# Altium project LedDispBoard.PrjPcb
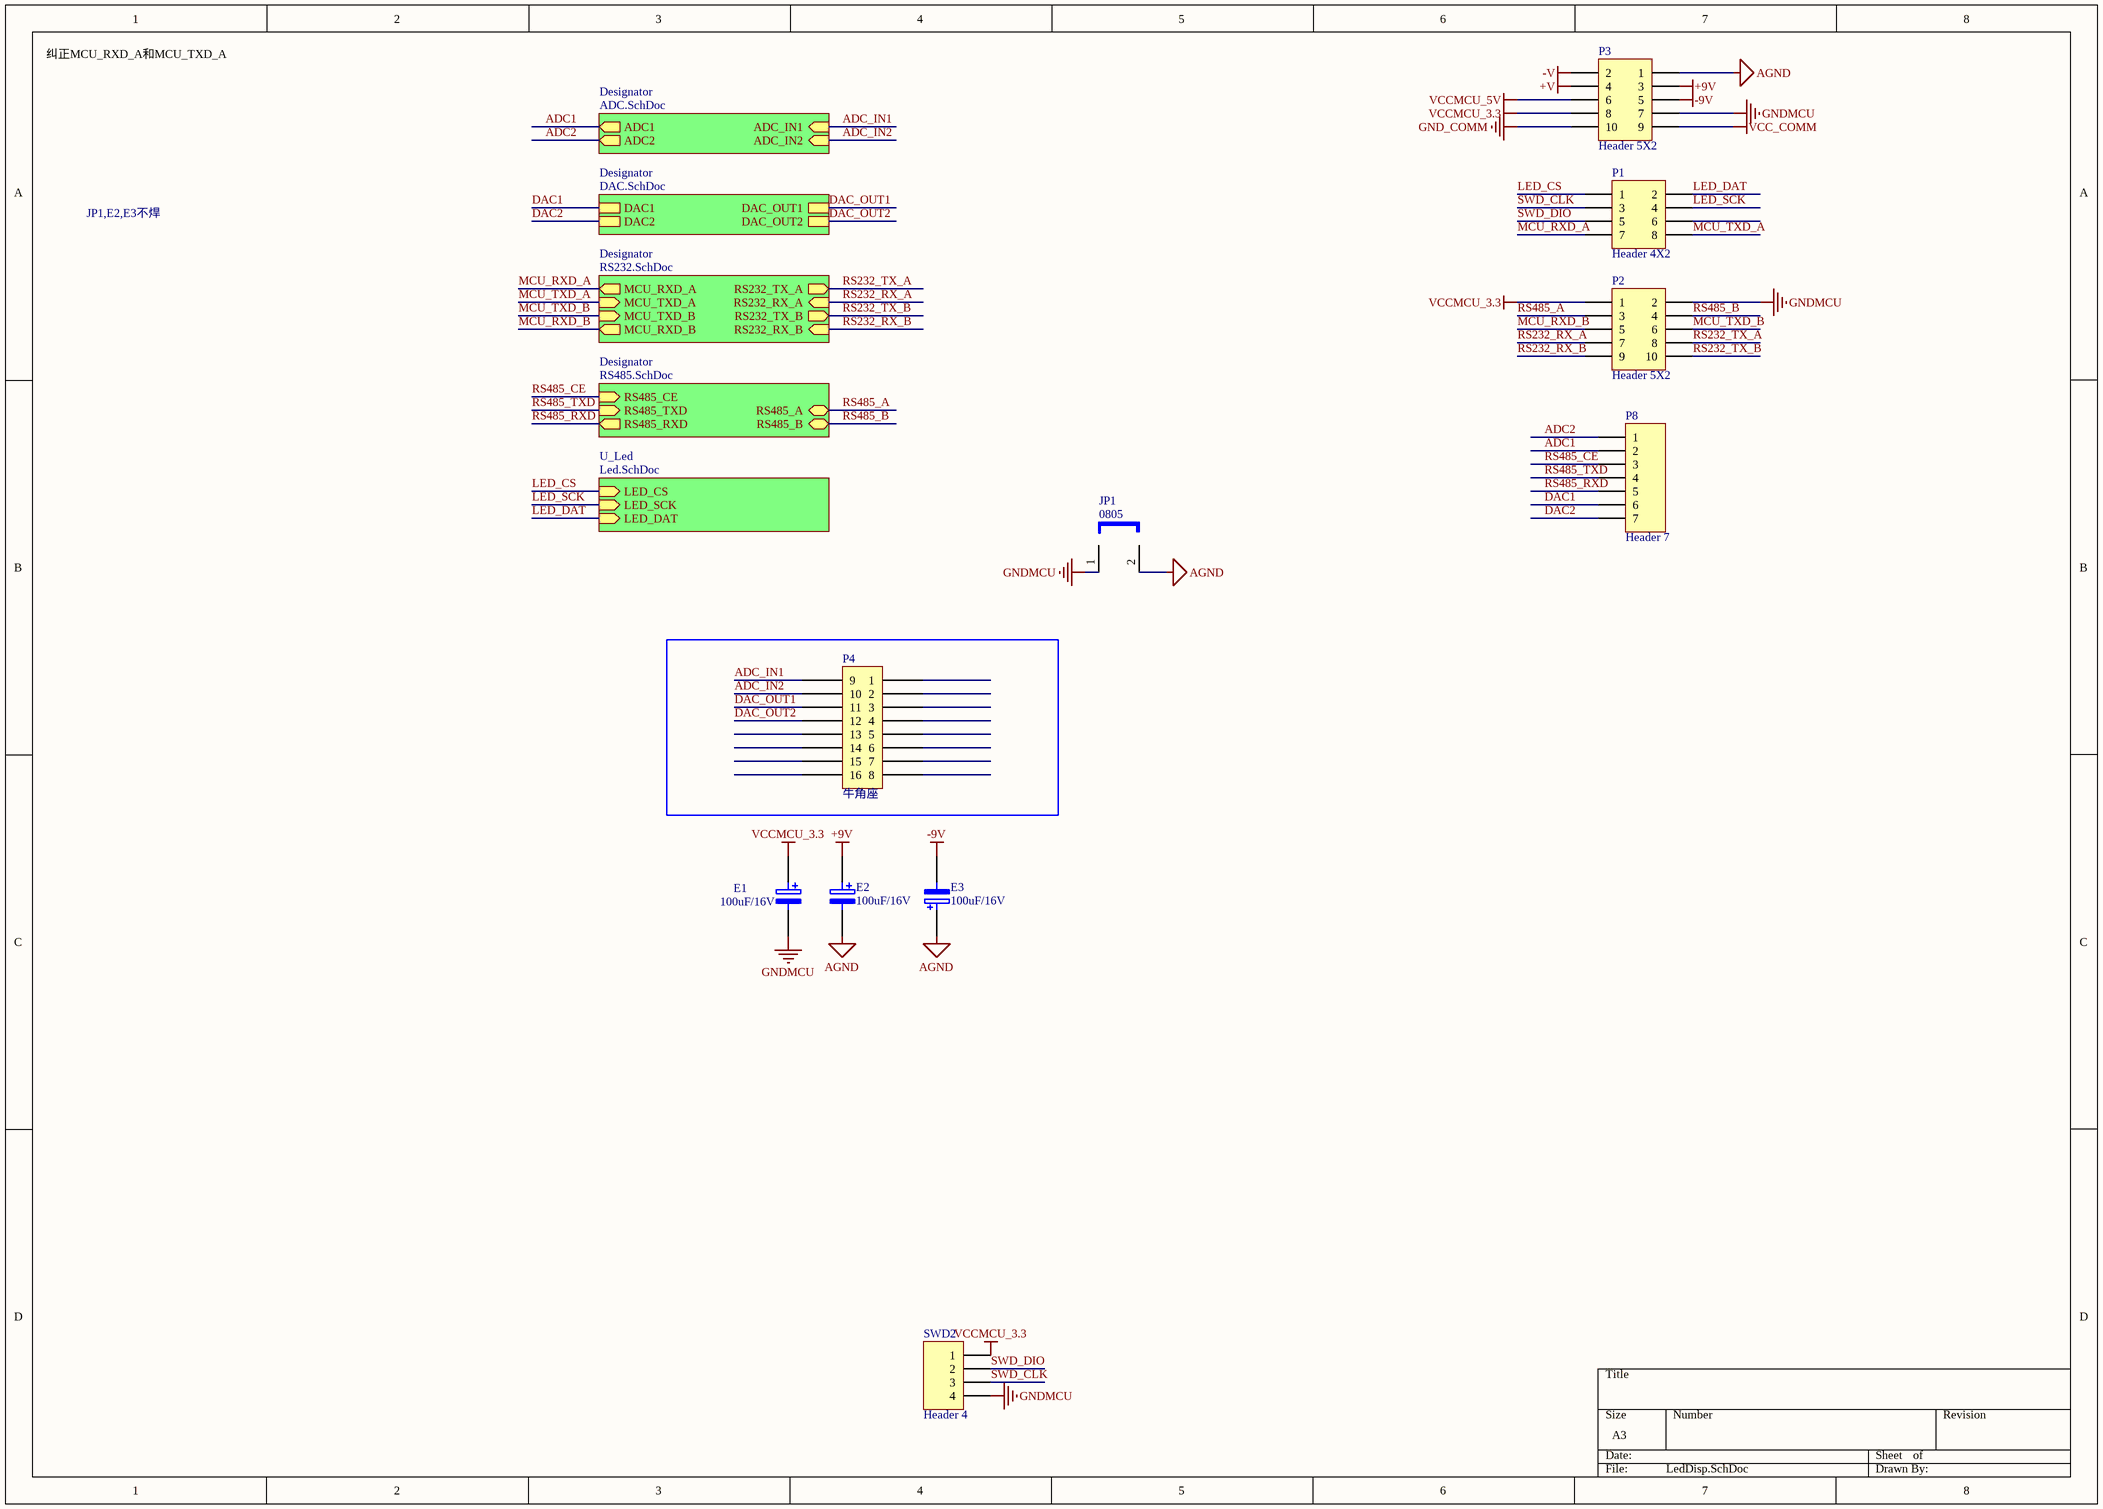
[diagram p0: LedDisp.SchDoc]
6 sheets, 169 parts. Net scope: hierarchical (ports join the sheet entries above them; power ports are global).
Board file: LedDispBoard.PcbDoc
Sheets:
  LedDisp.SchDoc
    Designator = ADC.SchDoc
    Designator = DAC.SchDoc
    Designator = RS232.SchDoc
    Designator = RS485.SchDoc
    U_Led = Led.SchDoc

## Sheet LedDisp.SchDoc
size A3

### Parts
E1  100uF/16V  [C-10UF]
E2  100uF/16V  [C-10UF]
E3  100uF/16V  [C-10UF]
JP1  0805  [RESC_E0805_2012X50N]
P1  Header 4X2  [HDR2X4]
P2  Header 5X2  [HDR2X5]
P3  Header 5X2  [HDR2X5]
P4  牛角座  [2.54* 2*8p]
P8  Header 7  [HDR1X7]
SWD2  Header 4  [HDR1X4]

### Sub-sheets
Designator = ADC.SchDoc: ADC1 (out), ADC_IN2 (in), ADC2 (out), ADC_IN1 (in)
Designator = DAC.SchDoc: DAC2, DAC1, DAC_OUT2, DAC_OUT1
Designator = RS232.SchDoc: RS232_RX_A (in), RS232_TX_A (out), RS232_TX_B (out), MCU_RXD_A (out), MCU_TXD_A (in), MCU_TXD_B (in), RS232_RX_B (in), MCU_RXD_B (out)
Designator = RS485.SchDoc: RS485_A (bidir), RS485_B (bidir), RS485_RXD (out), RS485_TXD (in), RS485_CE (in)
U_Led = Led.SchDoc: LED_CS (in), LED_SCK (in), LED_DAT (in)

### Nets
+9V: E2.1 P3.3
+V: P3.4
-9V: E3.2 P3.5
-V: P3.2
AGND: E2.2 E3.1 JP1.2 P3.1
GND_COMM: P3.10
GNDMCU: E1.2 JP1.1 P2.2 P3.7 SWD2.4
VCC_COMM: P3.9
VCCMCU_3.3: E1.1 P2.1 P3.8 SWD2.1
VCCMCU_5V: P3.6
ADC1: P8.2 ; sheet Designator/ADC1
ADC2: P8.1 ; sheet Designator/ADC2
ADC_IN1: P4.9 ; sheet Designator/ADC_IN1
ADC_IN2: P4.10 ; sheet Designator/ADC_IN2
DAC1: P8.6 ; sheet Designator/DAC1
DAC2: P8.7 ; sheet Designator/DAC2
DAC_OUT1: P4.11 ; sheet Designator/DAC_OUT1
DAC_OUT2: P4.12 ; sheet Designator/DAC_OUT2
LED_CS: P1.1 ; sheet U_Led/LED_CS
LED_DAT: P1.2 ; sheet U_Led/LED_DAT
LED_SCK: P1.4 ; sheet U_Led/LED_SCK
MCU_RXD_A: P1.7 ; sheet Designator/MCU_RXD_A
MCU_RXD_B: P2.5 ; sheet Designator/MCU_RXD_B
MCU_TXD_A: P1.8 ; sheet Designator/MCU_TXD_A
MCU_TXD_B: P2.6 ; sheet Designator/MCU_TXD_B
RS232_RX_A: P2.7 ; sheet Designator/RS232_RX_A
RS232_RX_B: P2.9 ; sheet Designator/RS232_RX_B
RS232_TX_A: P2.8 ; sheet Designator/RS232_TX_A
RS232_TX_B: P2.10 ; sheet Designator/RS232_TX_B
RS485_A: P2.3 ; sheet Designator/RS485_A
RS485_B: P2.4 ; sheet Designator/RS485_B
RS485_CE: P8.3 ; sheet Designator/RS485_CE
RS485_RXD: P8.5 ; sheet Designator/RS485_RXD
RS485_TXD: P8.4 ; sheet Designator/RS485_TXD
SWD_CLK: P1.3 SWD2.3
SWD_DIO: P1.5 SWD2.2

Not connected (* = marked no-connect by the designer): P1 6; P4 1 2 3 4 5 6 7 8 13 14 15 16

### Notes on the sheet
- 纠正MCU_RXD_A和MCU_TXD_A
- JP1,E2,E3不焊

### Library data of the parts
E1-E3 = ELECTRO2: Electrolytic Capacitor
JP1 = JUMPER
P1 = Header 4X2: Header, 4-Pin, Dual row; LatestRevisionDate: 17-Jul-2002; LatestRevisionNote: Re-released for DXP Platform.; Publisher: Altium Limited
P2 P3 = Header 5X2: Header, 5-Pin, Dual row; LatestRevisionDate: 17-Jul-2002; LatestRevisionNote: Re-released for DXP Platform.; Publisher: Altium Limited
P4 = CON2*8
P8 = Header 7: Header, 7-Pin; LatestRevisionDate: 17-Jul-2002; LatestRevisionNote: Re-released for DXP Platform.; Publisher: Altium Limited
SWD2 = Header 4: Header, 4-Pin; LatestRevisionDate: 17-Jul-2002; LatestRevisionNote: Re-released for DXP Platform.; Publisher: Altium Limited

## Sheet ADC.SchDoc
size A3
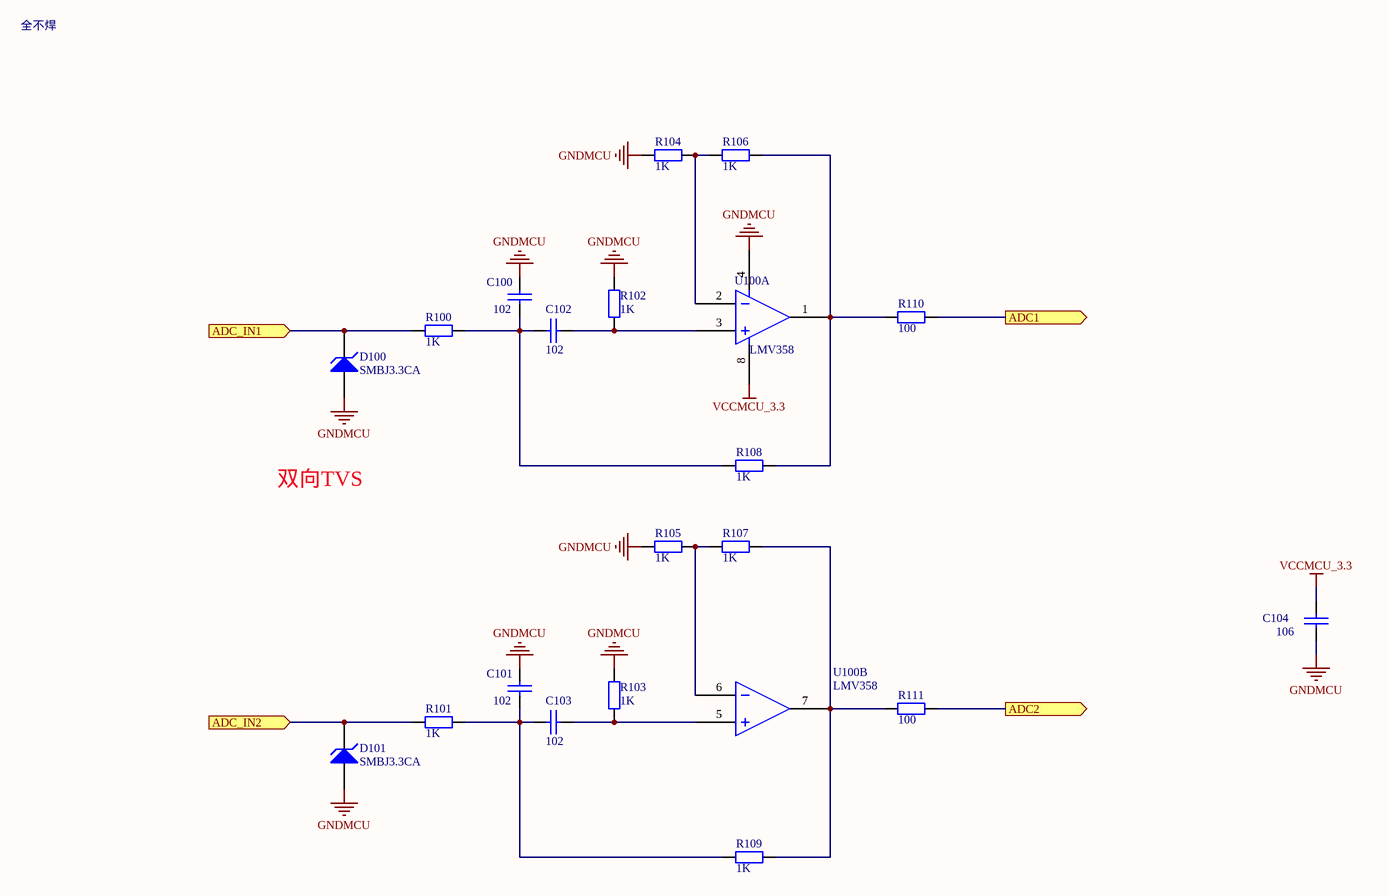
[diagram p1: ADC.SchDoc]

### Parts
C100  102  [0805/C2]
C101  102  [0805/C2]
C102  102  [0805/C2]
C103  102  [0805/C2]
C104  106  [0805/C2]
D100  SMBJ3.3CA  [SMB]
D101  SMBJ3.3CA  [SMB]
R100  1K  [0805/R2]
R101  1K  [0805/R2]
R102  1K  [0805/R2]
R103  1K  [0805/R2]
R104  1K  [0805/R2]
R105  1K  [0805/R2]
R106  1K  [0805/R2]
R107  1K  [0805/R2]
R108  1K  [0805/R2]
R109  1K  [0805/R2]
R110  100  [0805/R2]
R111  100  [0805/R2]
U100  LMV358  [SO-8]  (parts A,B of 2)

### Ports
ADC1 (out), ADC2 (out), ADC_IN1 (in), ADC_IN2 (in)

### Nets
GNDMCU: C100.1 C101.1 C104.2 D100.1(A) D101.1(A) R102.1 R103.1 R104.1 R105.1 U100.4
VCCMCU_3.3: C104.1 U100.8
ADC1: R110.1 ; port ADC1
ADC2: R111.1 ; port ADC2
ADC_IN1: D100.2(K) R100.2 ; port ADC_IN1
ADC_IN2: D101.2(K) R101.2 ; port ADC_IN2
NetC100_2: C100.2 C102.1 R100.1 R108.2
NetC101_2: C101.2 C103.1 R101.1 R109.2
NetC102_2: C102.2 R102.2 U100.3
NetC103_2: C103.2 R103.2 U100.5
NetR104_2: R104.2 R106.2 U100.2
NetR105_2: R105.2 R107.2 U100.6
NetR106_1: R106.1 R108.1 R110.2 U100.1
NetR107_1: R107.1 R109.1 R111.2 U100.7

### Notes on the sheet
- 全不焊
- 双向TVS

### Library data of the parts
C100-C104 = CAP: Capacitor
D100 D101 = D Zener: Zener Diode; Published: 8-Jun-2000; LatestRevisionDate: 17-Jul-2002; LatestRevisionNote: Re-released for DXP Platform.; PackageReference: DIODE-0.7; Publisher: Altium Limited
R100-R111 = RES1
U100 = 1458

## Sheet DAC.SchDoc
size A3
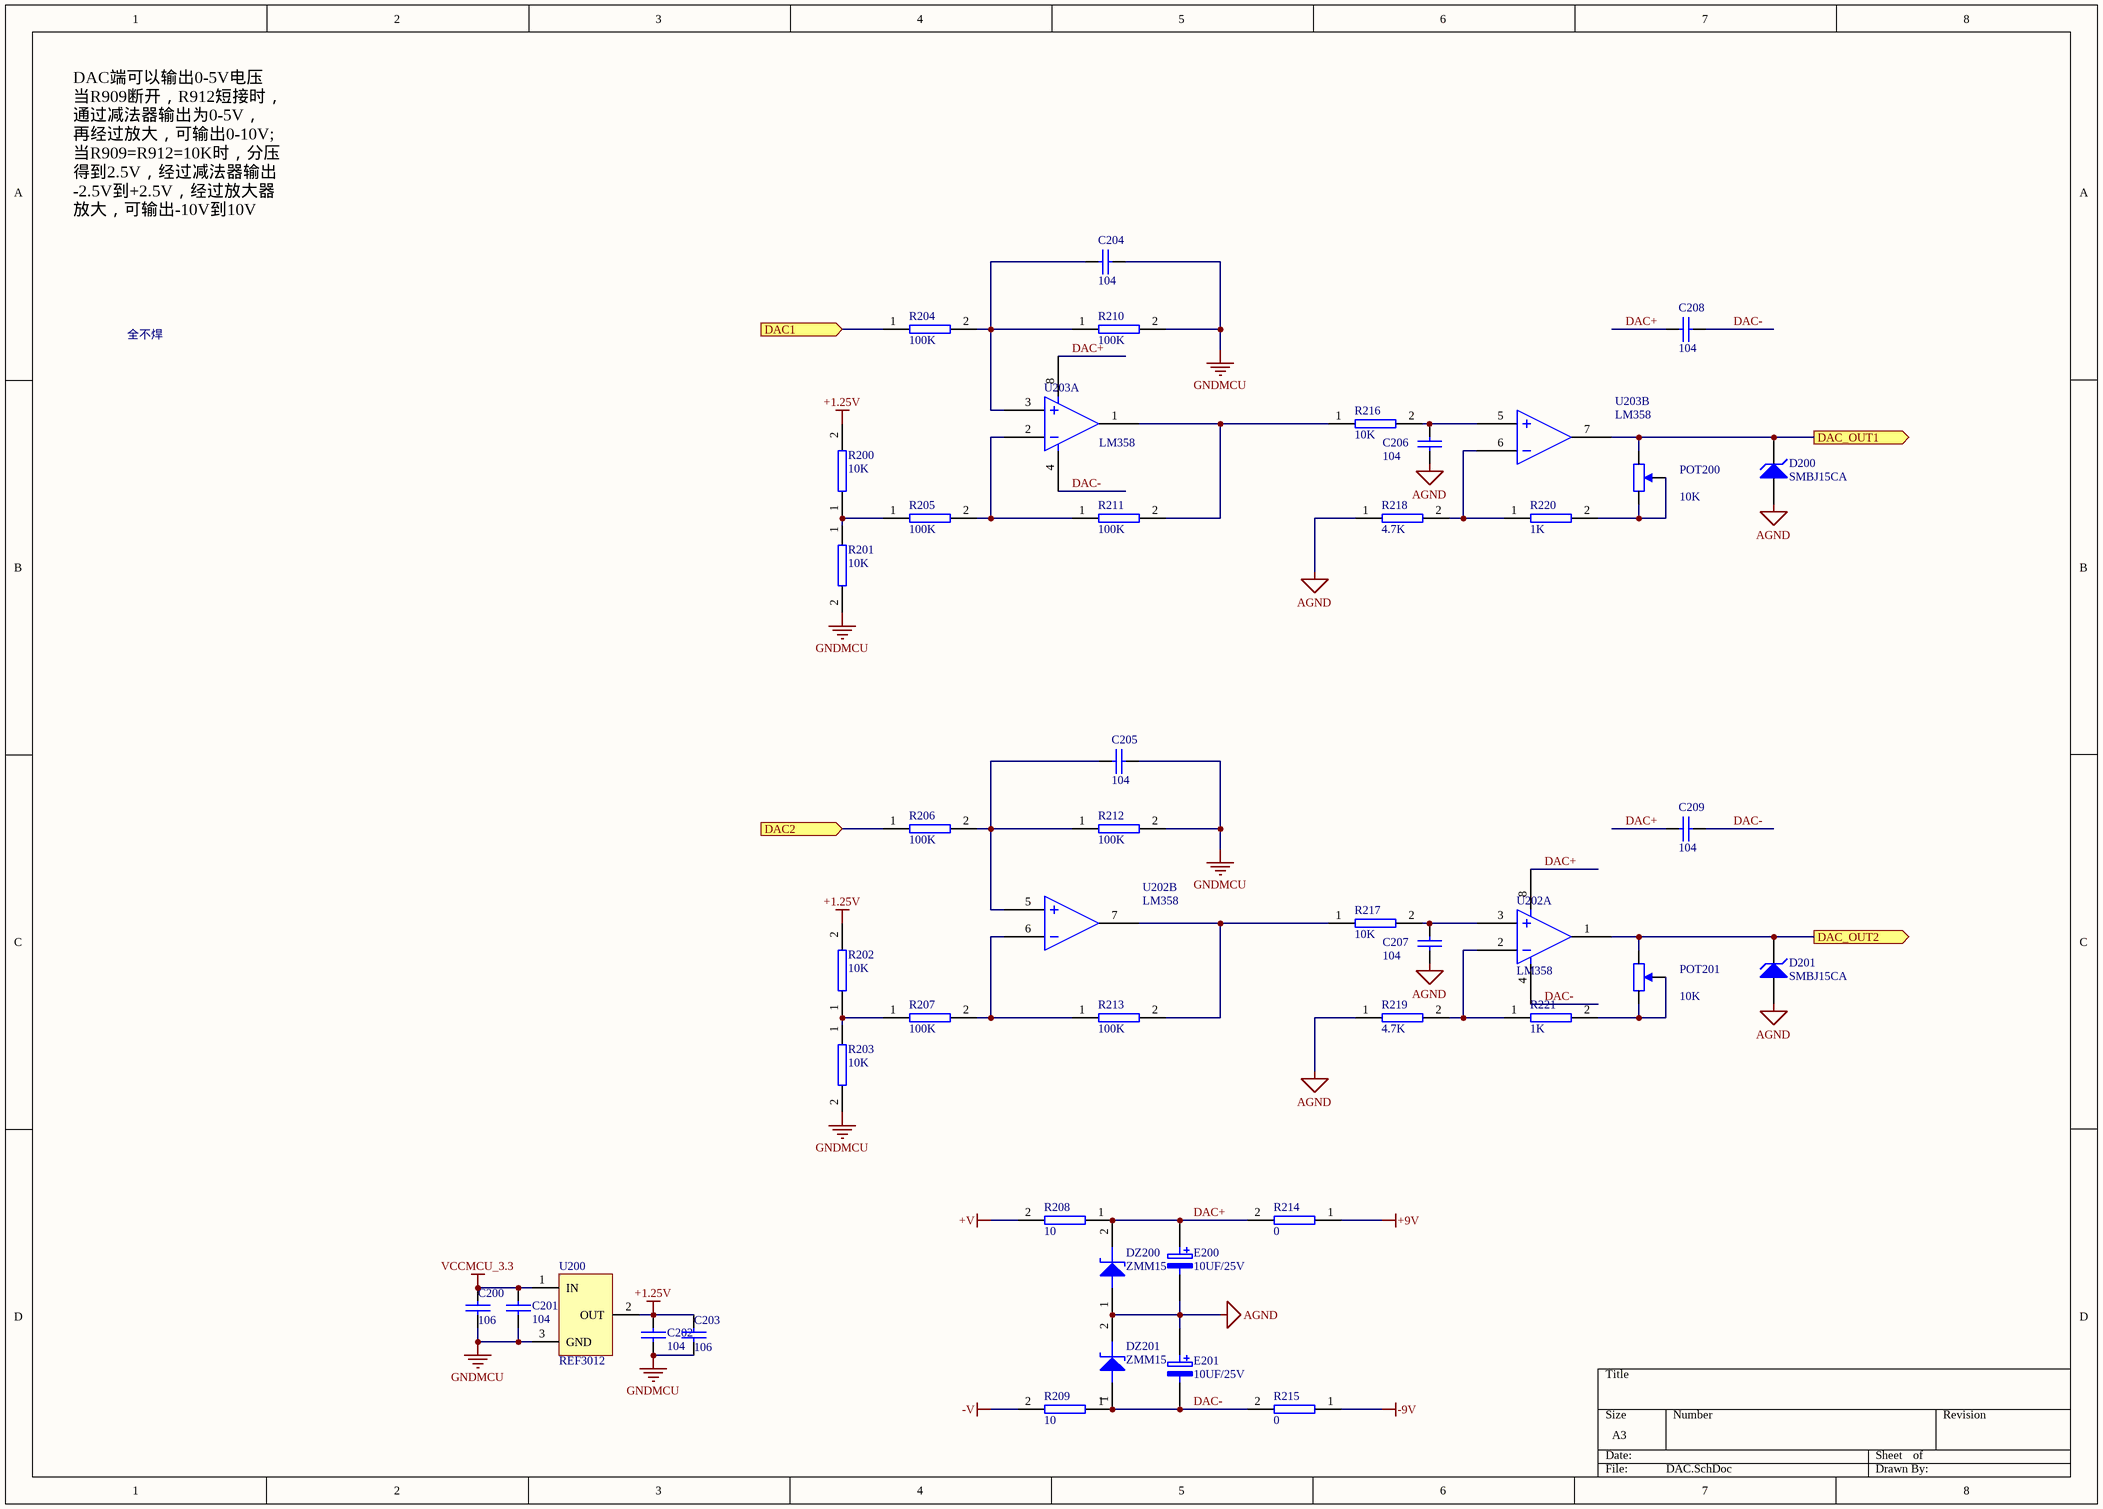
[diagram p2: DAC.SchDoc]

### Parts
C200  106  [0805/C2]
C201  104  [0805/C2]
C202  104  [0805/C2]
C203  106  [0805/C2]
C204  104  [0805/C2]
C205  104  [0805/C2]
C206  104  [0805/C2]
C207  104  [0805/C2]
C208  104  [0805/C2]
C209  104  [0805/C2]
D200  SMBJ15CA  [SMB]
D201  SMBJ15CA  [SMB]
DZ200  ZMM15  [N4148]
DZ201  ZMM15  [N4148]
E200  10UF/25V  [C-10UF]
E201  10UF/25V  [C-10UF]
POT200  10K  [RPOT-3296W]
POT201  10K  [rpOT-3296W]
R200  10K  [RESC_E0805_2012X50N]
R201  10K  [RESC_E0805_2012X50N]
R202  10K  [RESC_E0805_2012X50N]
R203  10K  [RESC_E0805_2012X50N]
R204  100K  [RESC_E0805_2012X50N]
R205  100K  [RESC_E0805_2012X50N]
R206  100K  [RESC_E0805_2012X50N]
R207  100K  [RESC_E0805_2012X50N]
R208  10  [RESC_E0805_2012X50N]
R209  10  [RESC_E0805_2012X50N]
R210  100K  [RESC_E0805_2012X50N]
R211  100K  [RESC_E0805_2012X50N]
R212  100K  [RESC_E0805_2012X50N]
R213  100K  [RESC_E0805_2012X50N]
R214  0  [RESC_E0805_2012X50N]
R215  0  [RESC_E0805_2012X50N]
R216  10K  [RESC_E0805_2012X50N]
R217  10K  [RESC_E0805_2012X50N]
R218  4.7K  [RESC_E0805_2012X50N]
R219  4.7K  [RESC_E0805_2012X50N]
R220  1K  [RESC_E0805_2012X50N]
R221  1K  [RESC_E0805_2012X50N]
U200  REF3012  [SOT-23]
U202  LM358  [sO-8]  (parts A,B of 2)
U203  LM358  [so-8]  (parts A,B of 2)

### Ports
DAC1 (in), DAC2 (in), DAC_OUT1 (out), DAC_OUT2 (out)

### Nets
+1.25V: C202.1 C203.2 R200.2 R202.2 U200.2(OUT)
+9V: R214.1
+V: R208.2
-9V: R215.1
-V: R209.2
AGND: C206.1 C207.1 D200.1(A) D201.1(A) DZ200.1 DZ201.2 E200.2 E201.1 R218.1 R219.1
GNDMCU: C200.1 C201.2 C202.2 C203.1 C204.2 C205.2 R201.2 R203.2 R210.2 R212.2 U200.3(GND)
VCCMCU_3.3: C200.2 C201.1 U200.1(IN)
DAC1: R204.1 ; port DAC1
DAC2: R206.1 ; port DAC2
DAC+: C208.1 C209.1 DZ200.2 E200.1 R208.1 R214.2 U202.8 U203.8
DAC-: C208.2 C209.2 DZ201.1 E201.2 R209.1 R215.2 U202.4 U203.4
DAC_OUT1: D200.2(K) POT200.1 U203.7 ; port DAC_OUT1
DAC_OUT2: D201.2(K) POT201.1 U202.1 ; port DAC_OUT2
NetC204_1: C204.1 R204.2 R210.1 U203.3
NetC205_1: C205.1 R206.2 R212.1 U202.5
NetC206_2: C206.2 R216.2 U203.5
NetC207_2: C207.2 R217.2 U202.3
NetPOT200_2: POT200.2 POT200.3 R220.2
NetPOT201_2: POT201.2 POT201.3 R221.2
NetR200_1: R200.1 R201.1 R205.1
NetR202_1: R202.1 R203.1 R207.1
NetR205_2: R205.2 R211.1 U203.2
NetR207_2: R207.2 R213.1 U202.6
NetR211_2: R211.2 R216.1 U203.1
NetR213_2: R213.2 R217.1 U202.7
NetR218_2: R218.2 R220.1 U203.6
NetR219_2: R219.2 R221.1 U202.2

### Notes on the sheet
- DAC端可以输出0-5V电压
  当R909断开，R912短接时，
  通过减法器输出为0-5V，
  再经过放大，可输出0-10V;
  当R909=R912=10K时，分压
  得到2.5V，经过减法器输出
  -2.5V到+2.5V，经过放大器
  放大，可输出-10V到10V
- 全不焊

### Library data of the parts
C200-C209 = CAP: Capacitor
D200 D201 = D Zener: Zener Diode; Published: 8-Jun-2000; LatestRevisionDate: 17-Jul-2002; LatestRevisionNote: Re-released for DXP Platform.; PackageReference: DIODE-0.7; Publisher: Altium Limited
DZ200 DZ201 = ZENER2: 15v/0.5W
E200 E201 = ELECTRO2: Electrolytic Capacitor
POT200 POT201 = RPOT2
R200-R221 = RES2
U200 = REF3020: 2.048V ,HIGH OUTPUT CURRENT: 25mA,HIGH ACCURACY: 0.2%
U202 U203 = 1458

## Sheet RS232.SchDoc
size A2; DocumentNumber: 4; SheetNumber: 4; SheetTotal: 9
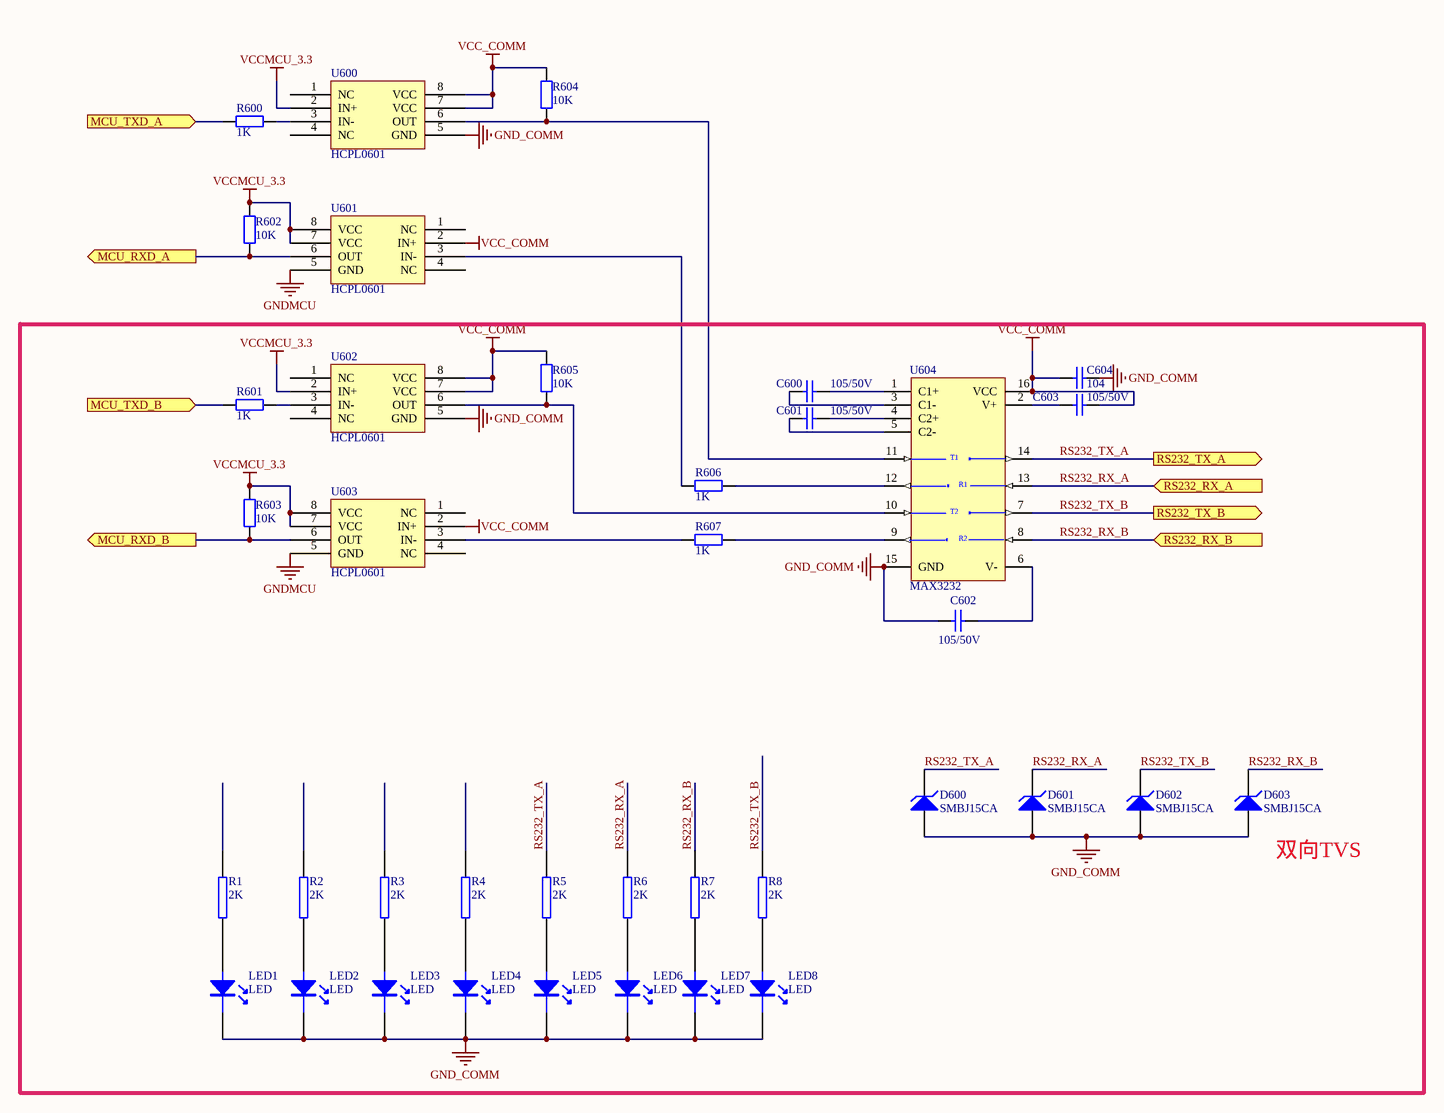
[diagram p3: RS232.SchDoc]

### Parts
C600  105/50V  [0805/C2]
C601  105/50V  [0805/C2]
C602  105/50V  [0805/C2]
C603  105/50V  [0805/C2]
C604  104  [0805/C2]
D600  SMBJ15CA  [SMB]
D601  SMBJ15CA  [SMB]
D602  SMBJ15CA  [SMB]
D603  SMBJ15CA  [SMB]
LED1  LED  [LED0805]
LED2  LED  [LED0805]
LED3  LED  [LED0805]
LED4  LED  [LED0805]
LED5  LED  [LED0805]
LED6  LED  [LED0805]
LED7  LED  [LED0805]
LED8  LED  [LED0805]
R1  2K  [0805/R2]
R2  2K  [0805/R2]
R3  2K  [0805/R2]
R4  2K  [0805/R2]
R5  2K  [0805/R2]
R6  2K  [0805/R2]
R7  2K  [0805/R2]
R8  2K  [0805/R2]
R600  1K  [0805/R2]
R601  1K  [0805/R2]
R602  10K  [0805/R2]
R603  10K  [0805/R2]
R604  10K  [0805/R2]
R605  10K  [0805/R2]
R606  1K  [0805/R2]
R607  1K  [RESC_E0805_2012X50N]
U600  HCPL0601  [HCPL0601]
U601  HCPL0601  [HCPL0601]
U602  HCPL0601  [HCPL0601]
U603  HCPL0601  [HCPL0601]
U604  MAX3232  [SO-16]

### Blocks framed on the sheet
双向TVS: C600-C604 D600-D603 LED1-LED8 R1-R8 R601 R603 R605-R607 U602-U604

### Ports
MCU_RXD_A (out), MCU_RXD_B (out), MCU_TXD_A (in), MCU_TXD_B (in), RS232_RX_A (in), RS232_RX_B (in), RS232_TX_A (out), RS232_TX_B (out)

### Nets
GND_COMM: C602.1 C604.1 D600.1(A) D601.1(A) D602.1(A) D603.1(A) LED1.2 LED2.2 LED3.2 LED4.2 LED5.2 LED6.2 LED7.2 LED8.2 U600.5(GND) U602.5(GND) U604.15(GND)
GNDMCU: U601.5(GND) U603.5(GND)
VCC_COMM: C603.2 C604.2 R604.2 R605.2 U600.7(VCC) U600.8(VCC) U601.2(IN+) U602.7(VCC) U602.8(VCC) U603.2(IN+) U604.16(VCC)
VCCMCU_3.3: R602.2 R603.2 U600.2(IN+) U601.7(VCC) U601.8(VCC) U602.2(IN+) U603.7(VCC) U603.8(VCC)
MCU_RXD_A: R602.1 U601.6(OUT) ; port MCU_RXD_A
MCU_RXD_B: R603.1 U603.6(OUT) ; port MCU_RXD_B
MCU_TXD_A: R600.1 ; port MCU_TXD_A
MCU_TXD_B: R601.1 ; port MCU_TXD_B
RS232_RX_A: D601.2(K) R6.2 U604.13(R1IN) ; port RS232_RX_A
RS232_RX_B: D603.2(K) R7.2 U604.8(R2IN) ; port RS232_RX_B
RS232_TX_A: D600.2(K) R5.2 U604.14(T1OUT) ; port RS232_TX_A
RS232_TX_B: D602.2(K) R8.2 U604.7(T2OUT) ; port RS232_TX_B
NetC600_1: C600.1 U604.1(C1+)
NetC600_2: C600.2 U604.3(C1-)
NetC601_1: C601.1 U604.4(C2+)
NetC601_2: C601.2 U604.5(C2-)
NetC602_2: C602.2 U604.6(V-)
NetC603_1: C603.1 U604.2(V+)
NetLED1_1: LED1.1 R1.1
NetLED2_1: LED2.1 R2.1
NetLED3_1: LED3.1 R3.1
NetLED4_1: LED4.1 R4.1
NetLED5_1: LED5.1 R5.1
NetLED6_1: LED6.1 R6.1
NetLED7_1: LED7.1 R7.1
NetLED8_1: LED8.1 R8.1
NetR600_2: R600.2 U600.3(IN-)
NetR601_2: R601.2 U602.3(IN-)
NetR604_1: R604.1 U600.6(OUT) U604.11(T1IN)
NetR605_1: R605.1 U602.6(OUT) U604.10(T2IN)
NetR606_1: R606.1 U601.3(IN-)
NetR606_2: R606.2 U604.12(R1OUT)
NetR607_1: R607.1 U603.3(IN-)
NetR607_2: R607.2 U604.9(R2OUT)

Not connected (* = marked no-connect by the designer): R1 2; R2 2; R3 2; R4 2; U600 1(NC) 4(NC); U601 1(NC) 4(NC); U602 1(NC) 4(NC); U603 1(NC) 4(NC)

### Notes on the sheet
- (in symbol MAX3232) T1; R1; T2; R2

### Library data of the parts
C600-C604 = CAP: Capacitor; Published: 8-Jun-2000; LatestRevisionDate: 17-Jul-2002; LatestRevisionNote: Re-released for DXP Platform.; PackageReference: RAD-0.3; Publisher: Altium Limited
D600-D603 = D Zener: Zener Diode; Published: 8-Jun-2000; LatestRevisionDate: 17-Jul-2002; LatestRevisionNote: Re-released for DXP Platform.; PackageReference: DIODE-0.7; Publisher: Altium Limited
LED1-LED8 = LED-PH
R1-R8 = RES2
R600-R607 = RES1
U600-U603 = 6N137

## Sheet RS485.SchDoc
size A4; DocumentNumber: 6; SheetNumber: 6; SheetTotal: 9
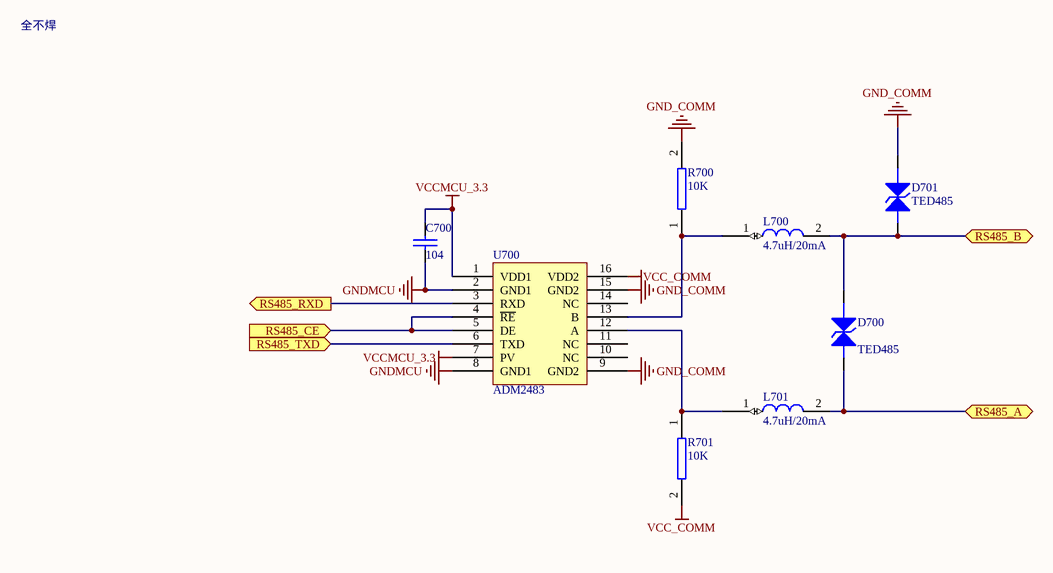
[diagram p4: RS485.SchDoc]

### Parts
C700  104  [0805/C2]
D700  TED485  [TED485]
D701  TED485  [TED485]
L700  4.7uH/20mA  [1210]
L701  4.7uH/20mA  [1210]
R700  10K  [0805/R2]
R701  10K  [0805/R2]
U700  ADM2483  [ADM2483-16]

### Ports
RS485_A (bidir), RS485_B (bidir), RS485_CE (in), RS485_RXD (out), RS485_TXD (in)

### Nets
GND_COMM: D701.2 R700.2 U700.9(GND2) U700.15(GND2)
GNDMCU: C700.1 U700.2(GND1) U700.8(GND1)
VCC_COMM: R701.2 U700.16(VDD2)
VCCMCU_3.3: C700.2 U700.1(VDD1) U700.7(PV)
RS485_A: D700.1 L701.2 ; port RS485_A
RS485_B: D700.2 D701.1 L700.2 ; port RS485_B
RS485_CE: U700.4(~{RE}) U700.5(DE) ; port RS485_CE
RS485_RXD: U700.3(RXD) ; port RS485_RXD
RS485_TXD: U700.6(TXD) ; port RS485_TXD
NetL700_1: L700.1 R700.1 U700.13(B)
NetL701_1: L701.1 R701.1 U700.12(A)

Not connected (* = marked no-connect by the designer): U700 10(NC) 11(NC) 14(NC)

### Notes on the sheet
- 全不焊
- Title
- Size:
- Date:
- A4
- Number:
- Time:
- Revision:
- Sheet
- of
- File:

### Library data of the parts
C700 = CAP: Capacitor
L700 L701 = FUSE
R700 R701 = RES2
U700 = RSM485CHT

## Sheet Led.SchDoc
size A3
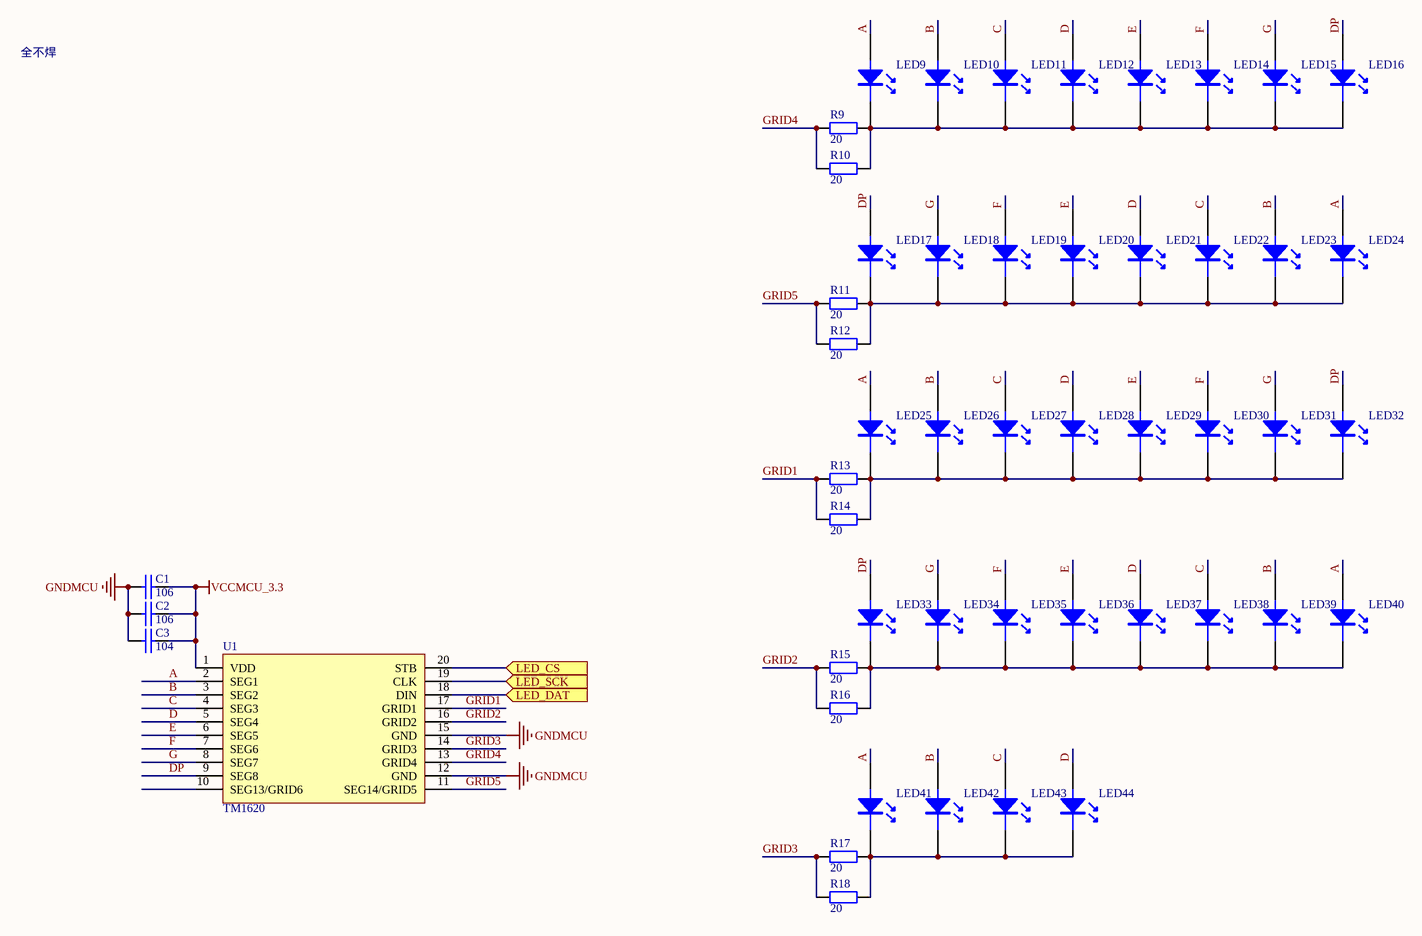
[diagram p5: Led.SchDoc]

### Parts
C1  106  [0805/C2]
C2  106  [0805/C2]
C3  104  [0805/C2]
LED9  (no value)  [LED0805]
LED10  (no value)  [LED0805]
LED11  (no value)  [LED0805]
LED12  (no value)  [LED0805]
LED13  (no value)  [LED0805]
LED14  (no value)  [LED0805]
LED15  (no value)  [LED0805]
LED16  (no value)  [LED0805]
LED17  (no value)  [LED0805]
LED18  (no value)  [LED0805]
LED19  (no value)  [LED0805]
LED20  (no value)  [LED0805]
LED21  (no value)  [LED0805]
LED22  (no value)  [LED0805]
LED23  (no value)  [LED0805]
LED24  (no value)  [LED0805]
LED25  (no value)  [LED0805]
LED26  (no value)  [LED0805]
LED27  (no value)  [LED0805]
LED28  (no value)  [LED0805]
LED29  (no value)  [LED0805]
LED30  (no value)  [LED0805]
LED31  (no value)  [LED0805]
LED32  (no value)  [LED0805]
LED33  (no value)  [LED0805]
LED34  (no value)  [LED0805]
LED35  (no value)  [LED0805]
LED36  (no value)  [LED0805]
LED37  (no value)  [LED0805]
LED38  (no value)  [LED0805]
LED39  (no value)  [LED0805]
LED40  (no value)  [LED0805]
LED41  (no value)  [LED0805]
LED42  (no value)  [LED0805]
LED43  (no value)  [LED0805]
LED44  (no value)  [LED0805]
R9  20  [0805/R2]
R10  20  [0805/R2]
R11  20  [0805/R2]
R12  20  [0805/R2]
R13  20  [0805/R2]
R14  20  [0805/R2]
R15  20  [0805/R2]
R16  20  [0805/R2]
R17  20  [0805/R2]
R18  20  [0805/R2]
U1  TM1620  [SOL-20]

### Ports
LED_CS (in), LED_DAT (in), LED_SCK (in)

### Nets
GNDMCU: C1.2 C2.2 C3.1 U1.12(GND) U1.15(GND)
VCCMCU_3.3: C1.1 C2.1 C3.2 U1.1(VDD)
A: LED9.1 LED24.1 LED25.1 LED40.1 LED41.1 U1.2(SEG1)
B: LED10.1 LED23.1 LED26.1 LED39.1 LED42.1 U1.3(SEG2)
C: LED11.1 LED22.1 LED27.1 LED38.1 LED43.1 U1.4(SEG3)
D: LED12.1 LED21.1 LED28.1 LED37.1 LED44.1 U1.5(SEG4)
DP: LED16.1 LED17.1 LED32.1 LED33.1 U1.9(SEG8)
E: LED13.1 LED20.1 LED29.1 LED36.1 U1.6(SEG5)
F: LED14.1 LED19.1 LED30.1 LED35.1 U1.7(SEG6)
G: LED15.1 LED18.1 LED31.1 LED34.1 U1.8(SEG7)
GRID1: R13.1 R14.1 U1.17(GRID1)
GRID2: R15.1 R16.1 U1.16(GRID2)
GRID3: R17.1 R18.1 U1.14(GRID3)
GRID4: R9.1 R10.1 U1.13(GRID4)
GRID5: R11.1 R12.1 U1.11(SEG14/GRID5)
LED_CS: U1.20(STB) ; port LED_CS
LED_DAT: U1.18(DIN) ; port LED_DAT
LED_SCK: U1.19(CLK) ; port LED_SCK
NetLED9_2: LED9.2 LED10.2 LED11.2 LED12.2 LED13.2 LED14.2 LED15.2 LED16.2 R9.2 R10.2
NetLED17_2: LED17.2 LED18.2 LED19.2 LED20.2 LED21.2 LED22.2 LED23.2 LED24.2 R11.2 R12.2
NetLED25_2: LED25.2 LED26.2 LED27.2 LED28.2 LED29.2 LED30.2 LED31.2 LED32.2 R13.2 R14.2
NetLED33_2: LED33.2 LED34.2 LED35.2 LED36.2 LED37.2 LED38.2 LED39.2 LED40.2 R15.2 R16.2
NetLED41_2: LED41.2 LED42.2 LED43.2 LED44.2 R17.2 R18.2

Not connected (* = marked no-connect by the designer): U1 10(SEG13/GRID6)

### Notes on the sheet
- 全不焊
- Title
- Size:
- Date:
- A3
- Number:
- Time:
- Revision:
- Sheet
- of
- File:

### Library data of the parts
C1-C3 = CAP: Capacitor
LED9-LED44 = LED-PH
R9-R18 = RES1
U1 = TM1620: 8 段×6 位～10段×4位 串行接口 共阴

## Nets that join several sheets
+9V: LedDisp (E2.1 P3.3), DAC (R214.1)
+V: LedDisp (P3.4), DAC (R208.2)
-9V: LedDisp (E3.2 P3.5), DAC (R215.1)
-V: LedDisp (P3.2), DAC (R209.2)
AGND: LedDisp (E2.2 E3.1 JP1.2 P3.1), DAC (10 pins)
GND_COMM: LedDisp (P3.10), RS232 (17 pins), RS485 (D701.2 R700.2 U700.9 U700.15)
GNDMCU: LedDisp (5 pins), ADC (10 pins), DAC (11 pins), RS232 (U601.5 U603.5), RS485 (C700.1 U700.2 U700.8), Led (5 pins)
VCC_COMM: LedDisp (P3.9), RS232 (11 pins), RS485 (R701.2 U700.16)
VCCMCU_3.3: LedDisp (E1.1 P2.1 P3.8 SWD2.1), ADC (C104.1 U100.8), DAC (C200.2 C201.1 U200.1), RS232 (8 pins), RS485 (C700.2 U700.1 U700.7), Led (C1.1 C2.1 C3.2 U1.1)
ADC1: LedDisp (P8.2), ADC (R110.1)
ADC2: LedDisp (P8.1), ADC (R111.1)
ADC_IN1: LedDisp (P4.9), ADC (D100.2 R100.2)
ADC_IN2: LedDisp (P4.10), ADC (D101.2 R101.2)
DAC1: LedDisp (P8.6), DAC (R204.1)
DAC2: LedDisp (P8.7), DAC (R206.1)
DAC_OUT1: LedDisp (P4.11), DAC (D200.2 POT200.1 U203.7)
DAC_OUT2: LedDisp (P4.12), DAC (D201.2 POT201.1 U202.1)
LED_CS: LedDisp (P1.1), Led (U1.20)
LED_DAT: LedDisp (P1.2), Led (U1.18)
LED_SCK: LedDisp (P1.4), Led (U1.19)
MCU_RXD_A: LedDisp (P1.7), RS232 (R602.1 U601.6)
MCU_RXD_B: LedDisp (P2.5), RS232 (R603.1 U603.6)
MCU_TXD_A: LedDisp (P1.8), RS232 (R600.1)
MCU_TXD_B: LedDisp (P2.6), RS232 (R601.1)
RS232_RX_A: LedDisp (P2.7), RS232 (D601.2 R6.2 U604.13)
RS232_RX_B: LedDisp (P2.9), RS232 (D603.2 R7.2 U604.8)
RS232_TX_A: LedDisp (P2.8), RS232 (D600.2 R5.2 U604.14)
RS232_TX_B: LedDisp (P2.10), RS232 (D602.2 R8.2 U604.7)
RS485_A: LedDisp (P2.3), RS485 (D700.1 L701.2)
RS485_B: LedDisp (P2.4), RS485 (D700.2 D701.1 L700.2)
RS485_CE: LedDisp (P8.3), RS485 (U700.4 U700.5)
RS485_RXD: LedDisp (P8.5), RS485 (U700.3)
RS485_TXD: LedDisp (P8.4), RS485 (U700.6)